# EAGLE schematic untitled (EAGLE 7.6.0)
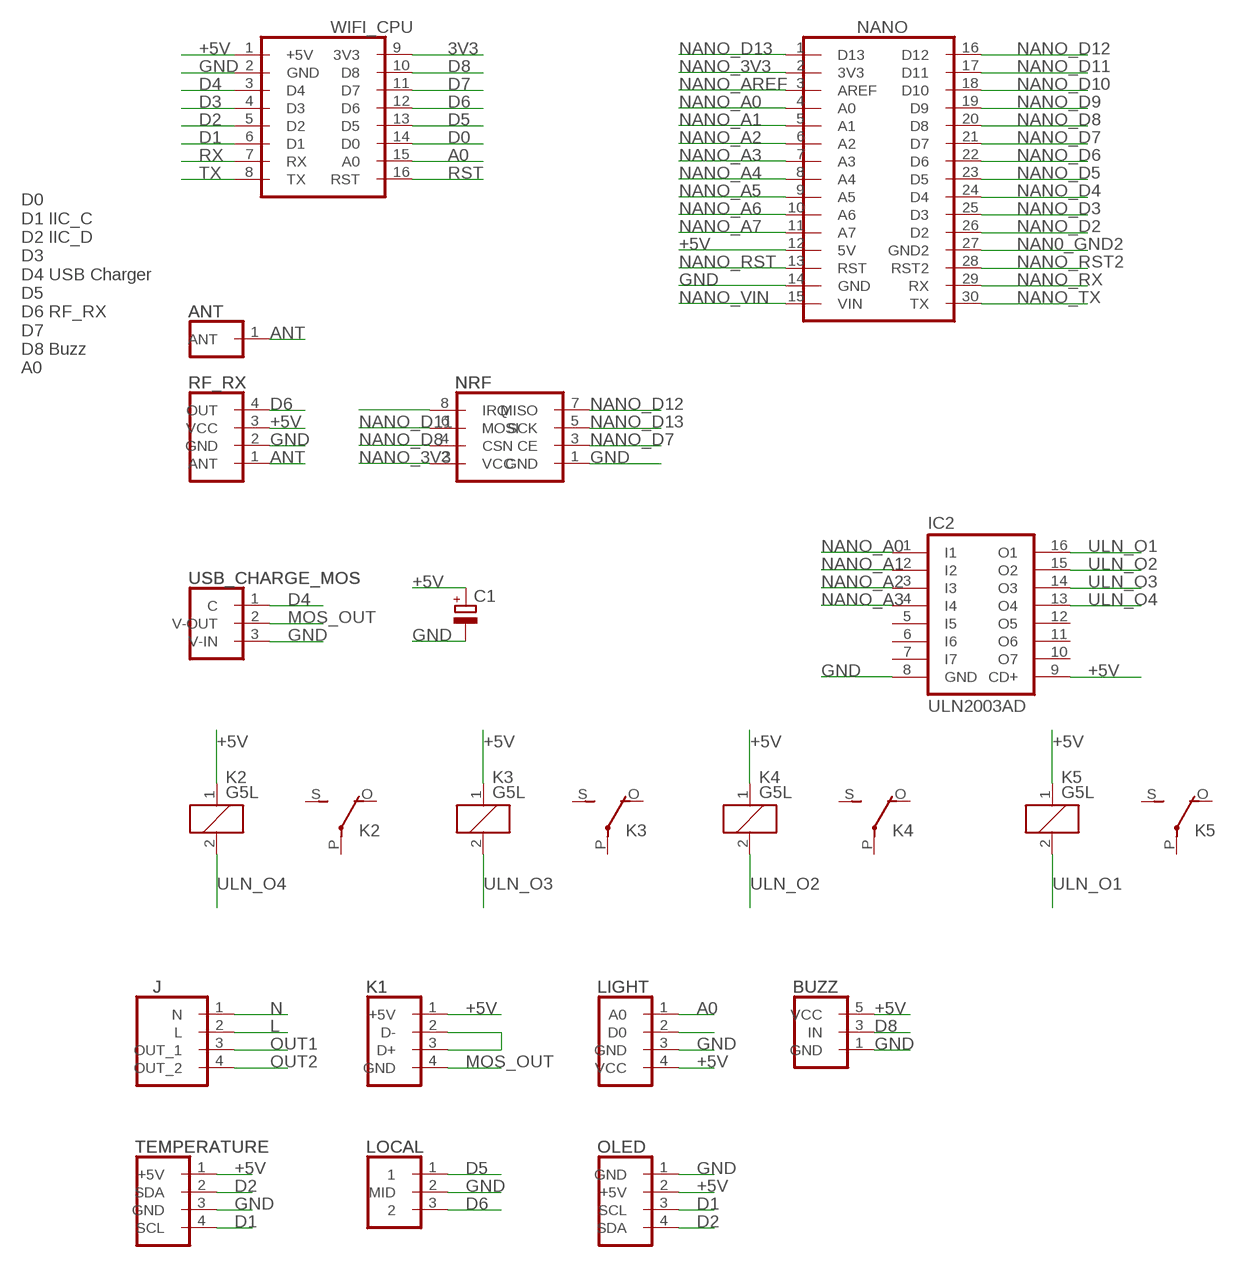
[diagram p0: schematic, sheet 1]

## Parts
ANT  ANT_315  [ANT_315]
BUZZ  BUZZ_MODULE  [BUZZ_MODULE]
C1  CPOL-EUE5-5  [E5-5]
IC2  ULN2003AD  [SO16]
J  OUT_HEAD_4_AC_2CH  [OUT_HEAD_4_AC_2CH]
K1  USB_OUTUSB_V  [USB_V_OUT]
K2  G5L  [G5LE]
K3  G5L  [G5LE]
K4  G5L  [G5LE]
K5  G5L  [G5LE]
LIGHT  LIGHT_DEC  [LIGHT_DEC]
LOCAL  SELECT_3  [SELECT_3]
NANO  ARDUINO_NANO  [ARDUINO_NANO]
NRF  NRF24L01_MODULE  [NRF24L01]
OLED  IIC_OLED  [IIC_OLED]
RF_RX  315MHZ_RX_SMT  [315MHZ_RX_SMT]
TEMPERATURE  IIC_TEMPERATURE  [IIC_TEMPERATURE]
USB_CHARGE_MOS  MOS_IRF520  [MOS_IRF520]
WIFI_CPU  ESP8266_MINI  [ESP8266_MINI]

## Nets
3V3: WIFI_CPU.9(3V3)
+5V: BUZZ.5(VCC) C1.+ IC2.9(CD+) K1.1(+5V) K2.1 K3.1 K4.1 K5.1 LIGHT.4(VCC) NANO.12(5V) OLED.2(+5V) RF_RX.3(VCC) TEMPERATURE.1(+5V) WIFI_CPU.1(+5V)
A0: LIGHT.1(A0) WIFI_CPU.15(A0)
ANT: ANT.1(ANT) RF_RX.1(ANT)
D0: WIFI_CPU.14(D0)
D1: OLED.3(SCL) TEMPERATURE.4(SCL) WIFI_CPU.6(D1)
D2: OLED.4(SDA) TEMPERATURE.2(SDA) WIFI_CPU.5(D2)
D3: WIFI_CPU.4(D3)
D4: USB_CHARGE_MOS.1(C) WIFI_CPU.3(D4)
D5: LOCAL.1 WIFI_CPU.13(D5)
D6: LOCAL.3 RF_RX.4(OUT) WIFI_CPU.12(D6)
D7: WIFI_CPU.11(D7)
D8: BUZZ.3(IN) WIFI_CPU.10(D8)
GND: BUZZ.1(GND) C1.- IC2.8(GND) LIGHT.3(GND) LOCAL.2(MID) NANO.14(GND) NRF.1(GND) OLED.1(GND) RF_RX.2(GND) TEMPERATURE.3(GND) USB_CHARGE_MOS.3(V-IN) WIFI_CPU.2(GND)
L: J.2(L)
MOS_OUT: K1.4(GND) USB_CHARGE_MOS.2(V-OUT)
N: J.1(N)
N$1: NRF.8(IRQ)
N$2: K1.2(D-) K1.3(D+)
N$3: LIGHT.2(D0)
NAN0_GND2: NANO.27(GND2)
NANO_3V3: NANO.2(3V3) NRF.2(VCC)
NANO_A0: IC2.1(I1) NANO.4(A0)
NANO_A1: IC2.2(I2) NANO.5(A1)
NANO_A2: IC2.3(I3) NANO.6(A2)
NANO_A3: IC2.4(I4) NANO.7(A3)
NANO_A4: NANO.8(A4)
NANO_A5: NANO.9(A5)
NANO_A6: NANO.10(A6)
NANO_A7: NANO.11(A7)
NANO_AREF: NANO.3(AREF)
NANO_D2: NANO.26(D2)
NANO_D3: NANO.25(D3)
NANO_D4: NANO.24(D4)
NANO_D5: NANO.23(D5)
NANO_D6: NANO.22(D6)
NANO_D7: NANO.21(D7) NRF.3(CE)
NANO_D8: NANO.20(D8) NRF.4(CSN)
NANO_D9: NANO.19(D9)
NANO_D10: NANO.18(D10)
NANO_D11: NANO.17(D11) NRF.6(MOSI)
NANO_D12: NANO.16(D12) NRF.7(MISO)
NANO_D13: NANO.1(D13) NRF.5(SCK)
NANO_RST: NANO.13(RST)
NANO_RST2: NANO.28(RST2)
NANO_RX: NANO.29(RX)
NANO_TX: NANO.30(TX)
NANO_VIN: NANO.15(VIN)
OUT1: J.3(OUT_1)
OUT2: J.4(OUT_2)
RST: WIFI_CPU.16(RST)
RX: WIFI_CPU.7(RX)
TX: WIFI_CPU.8(TX)
ULN_O1: IC2.16(O1) K5.2
ULN_O2: IC2.15(O2) K4.2
ULN_O3: IC2.14(O3) K3.2
ULN_O4: IC2.13(O4) K2.2
Unconnected: IC2.5(I5) IC2.6(I6) IC2.7(I7) IC2.10(O7) IC2.11(O6) IC2.12(O5) K2.O(2:O) K2.P(2:P) K2.S(2:S) K3.O(2:O) K3.P(2:P) K3.S(2:S) K4.O(2:O) K4.P(2:P) K4.S(2:S) K5.O(2:O) K5.P(2:P) K5.S(2:S)

## Notes on the sheet
- D0
  D1 IIC_C
  D2 IIC_D
  D3
  D4 USB Charger
  D5
  D6 RF_RX
  D7
  D8 Buzz
  A0

## Library data of the parts
ANT = rx:ANT_315: Multi connection point. Often used as Generic Header-pin footprint for 0.1 inch spaced/style header connections On any of the 0.1 inch spaced packages, you can populate with these: Break Away Headers - Straight <https://www.sparkfun.com/products/116> (PRT-00116) Break Away Male Headers - Right Angle <https://www.sparkfun.com/products/553> (PRT-00553) Female Headers <https://www.sparkfun.com/products/115> (PRT-00115) Break Away Headers - Machine Pin <https://www.sparkfun.com/products/117> (PRT-00117) Break Away Female Headers - Swiss Machine Pin <https://www.sparkfun.com/products/743> (PRT-00743)
BUZZ = rx:BUZZ_MODULE: Multi connection point. Often used as Generic Header-pin footprint for 0.1 inch spaced/style header connections On any of the 0.1 inch spaced packages, you can populate with these: Break Away Headers - Straight <https://www.sparkfun.com/products/116> (PRT-00116) Break Away Male Headers - Right Angle <https://www.sparkfun.com/products/553> (PRT-00553) Female Headers <https://www.sparkfun.com/products/115> (PRT-00115) Break Away Headers - Machine Pin <https://www.sparkfun.com/products/117> (PRT-00117) Break Away Female Headers - Swiss Machine Pin <https://www.sparkfun.com/products/743> (PRT-00743)
C1 = resistor:CPOL-EU: POLARIZED CAPACITOR, European symbol
IC2 = uln-udn:ULN2003A: DRIVER ARRAY
J = rx:OUT_HEAD_4_AC_2CH: Multi connection point. Often used as Generic Header-pin footprint for 0.1 inch spaced/style header connections On any of the 0.1 inch spaced packages, you can populate with these: Break Away Headers - Straight <https://www.sparkfun.com/products/116> (PRT-00116) Break Away Male Headers - Right Angle <https://www.sparkfun.com/products/553> (PRT-00553) Female Headers <https://www.sparkfun.com/products/115> (PRT-00115) Break Away Headers - Machine Pin <https://www.sparkfun.com/products/117> (PRT-00117) Break Away Female Headers - Swiss Machine Pin <https://www.sparkfun.com/products/743> (PRT-00743)
K1 = rx:USB_OUT: Multi connection point. Often used as Generic Header-pin footprint for 0.1 inch spaced/style header connections On any of the 0.1 inch spaced packages, you can populate with these: Break Away Headers - Straight <https://www.sparkfun.com/products/116> (PRT-00116) Break Away Male Headers - Right Angle <https://www.sparkfun.com/products/553> (PRT-00553) Female Headers <https://www.sparkfun.com/products/115> (PRT-00115) Break Away Headers - Machine Pin <https://www.sparkfun.com/products/117> (PRT-00117) Break Away Female Headers - Swiss Machine Pin <https://www.sparkfun.com/products/743> (PRT-00743)
K2-K5 = relay:G5L: RELAY 1 x switch, 10 A/120 V AC, 8 A/30 V ADC, Omron; OC_FARNELL: unknown; OC_NEWARK: unknown
LIGHT = rx:LIGHT_DEC: Multi connection point. Often used as Generic Header-pin footprint for 0.1 inch spaced/style header connections On any of the 0.1 inch spaced packages, you can populate with these: Break Away Headers - Straight <https://www.sparkfun.com/products/116> (PRT-00116) Break Away Male Headers - Right Angle <https://www.sparkfun.com/products/553> (PRT-00553) Female Headers <https://www.sparkfun.com/products/115> (PRT-00115) Break Away Headers - Machine Pin <https://www.sparkfun.com/products/117> (PRT-00117) Break Away Female Headers - Swiss Machine Pin <https://www.sparkfun.com/products/743> (PRT-00743)
LOCAL = rx:SELECT_3: Multi connection point. Often used as Generic Header-pin footprint for 0.1 inch spaced/style header connections On any of the 0.1 inch spaced packages, you can populate with these: Break Away Headers - Straight <https://www.sparkfun.com/products/116> (PRT-00116) Break Away Male Headers - Right Angle <https://www.sparkfun.com/products/553> (PRT-00553) Female Headers <https://www.sparkfun.com/products/115> (PRT-00115) Break Away Headers - Machine Pin <https://www.sparkfun.com/products/117> (PRT-00117) Break Away Female Headers - Swiss Machine Pin <https://www.sparkfun.com/products/743> (PRT-00743)
NANO = rx:ARDUINO_NANO: Multi connection point. Often used as Generic Header-pin footprint for 0.1 inch spaced/style header connections On any of the 0.1 inch spaced packages, you can populate with these: Break Away Headers - Straight <https://www.sparkfun.com/products/116> (PRT-00116) Break Away Male Headers - Right Angle <https://www.sparkfun.com/products/553> (PRT-00553) Female Headers <https://www.sparkfun.com/products/115> (PRT-00115) Break Away Headers - Machine Pin <https://www.sparkfun.com/products/117> (PRT-00117) Break Away Female Headers - Swiss Machine Pin <https://www.sparkfun.com/products/743> (PRT-00743) For SCREWTERMINALS and SPRING TERMINALS visit here: Screw Terimnals on SparkFun.com <https://www.sparkfun.com/search/results?term=Screw+Terminals> (5mm/3.5mm/2.54mm spacing) This device is also useful as a general connection point to wire up your design to another part of your project. Our various solder wires solder well into these plated through hole pads. Hook-Up Wire - Assortment (Stranded, 22 AWG) <https://www.sparkfun.com/products/11375> (PRT-11375) Hook-Up Wire - Assortment (Solid Core, 22 AWG) <https://www.sparkfun.com/products/11367> (PRT-11367) View the entire wire category on our website here <https://www.sparkfun.com/categories/141> Special notes: Molex polarized connector foot print use with SKU : PRT-08231 with associated crimp pins and housings. 1MM SMD Version SKU: PRT-10208 NOTES ON THE VARIANTS LOCK and LOCK_LONGPADS... This footprint was designed to help hold the alignment of a through-hole component (i.e. 6-pin header) while soldering it into place. You may notice that each hole has been shifted either up or down by 0.005 of an inch from it's more standard position (which is a perfectly straight line). This slight alteration caused the pins (the squares in the middle) to touch the edges of the holes. Because they are alternating, it causes a "brace" to hold the component in place. 0.005 has proven to be the perfect amount of "off-center" position when using our standard breakaway headers. Although looks a little odd when you look at the bare footprint, once you have a header in there, the alteration is very hard to notice. Also,if you push a header all the way into place, it is covered up entirely on the bottom side.
NRF = rx:NRF24L01_MODULE: Multi connection point. Often used as Generic Header-pin footprint for 0.1 inch spaced/style header connections On any of the 0.1 inch spaced packages, you can populate with these: Break Away Headers - Straight <https://www.sparkfun.com/products/116> (PRT-00116) Break Away Male Headers - Right Angle <https://www.sparkfun.com/products/553> (PRT-00553) Female Headers <https://www.sparkfun.com/products/115> (PRT-00115) Break Away Headers - Machine Pin <https://www.sparkfun.com/products/117> (PRT-00117) Break Away Female Headers - Swiss Machine Pin <https://www.sparkfun.com/products/743> (PRT-00743)
OLED = rx:IIC_OLED: Multi connection point. Often used as Generic Header-pin footprint for 0.1 inch spaced/style header connections On any of the 0.1 inch spaced packages, you can populate with these: Break Away Headers - Straight <https://www.sparkfun.com/products/116> (PRT-00116) Break Away Male Headers - Right Angle <https://www.sparkfun.com/products/553> (PRT-00553) Female Headers <https://www.sparkfun.com/products/115> (PRT-00115) Break Away Headers - Machine Pin <https://www.sparkfun.com/products/117> (PRT-00117) Break Away Female Headers - Swiss Machine Pin <https://www.sparkfun.com/products/743> (PRT-00743)
RF_RX = rx:315MHZ_RX_SMT: Multi connection point. Often used as Generic Header-pin footprint for 0.1 inch spaced/style header connections On any of the 0.1 inch spaced packages, you can populate with these: Break Away Headers - Straight <https://www.sparkfun.com/products/116> (PRT-00116) Break Away Male Headers - Right Angle <https://www.sparkfun.com/products/553> (PRT-00553) Female Headers <https://www.sparkfun.com/products/115> (PRT-00115) Break Away Headers - Machine Pin <https://www.sparkfun.com/products/117> (PRT-00117) Break Away Female Headers - Swiss Machine Pin <https://www.sparkfun.com/products/743> (PRT-00743)
TEMPERATURE = rx:IIC_TEMPERATURE: Multi connection point. Often used as Generic Header-pin footprint for 0.1 inch spaced/style header connections On any of the 0.1 inch spaced packages, you can populate with these: Break Away Headers - Straight <https://www.sparkfun.com/products/116> (PRT-00116) Break Away Male Headers - Right Angle <https://www.sparkfun.com/products/553> (PRT-00553) Female Headers <https://www.sparkfun.com/products/115> (PRT-00115) Break Away Headers - Machine Pin <https://www.sparkfun.com/products/117> (PRT-00117) Break Away Female Headers - Swiss Machine Pin <https://www.sparkfun.com/products/743> (PRT-00743)
USB_CHARGE_MOS = rx:MOS_IRF520: Multi connection point. Often used as Generic Header-pin footprint for 0.1 inch spaced/style header connections On any of the 0.1 inch spaced packages, you can populate with these: Break Away Headers - Straight <https://www.sparkfun.com/products/116> (PRT-00116) Break Away Male Headers - Right Angle <https://www.sparkfun.com/products/553> (PRT-00553) Female Headers <https://www.sparkfun.com/products/115> (PRT-00115) Break Away Headers - Machine Pin <https://www.sparkfun.com/products/117> (PRT-00117) Break Away Female Headers - Swiss Machine Pin <https://www.sparkfun.com/products/743> (PRT-00743)
WIFI_CPU = rx:ESP8266_MINI: Multi connection point. Often used as Generic Header-pin footprint for 0.1 inch spaced/style header connections On any of the 0.1 inch spaced packages, you can populate with these: Break Away Headers - Straight <https://www.sparkfun.com/products/116> (PRT-00116) Break Away Male Headers - Right Angle <https://www.sparkfun.com/products/553> (PRT-00553) Female Headers <https://www.sparkfun.com/products/115> (PRT-00115) Break Away Headers - Machine Pin <https://www.sparkfun.com/products/117> (PRT-00117) Break Away Female Headers - Swiss Machine Pin <https://www.sparkfun.com/products/743> (PRT-00743)